# Altium schematic sheet 继电器模块.SchDoc
size A3
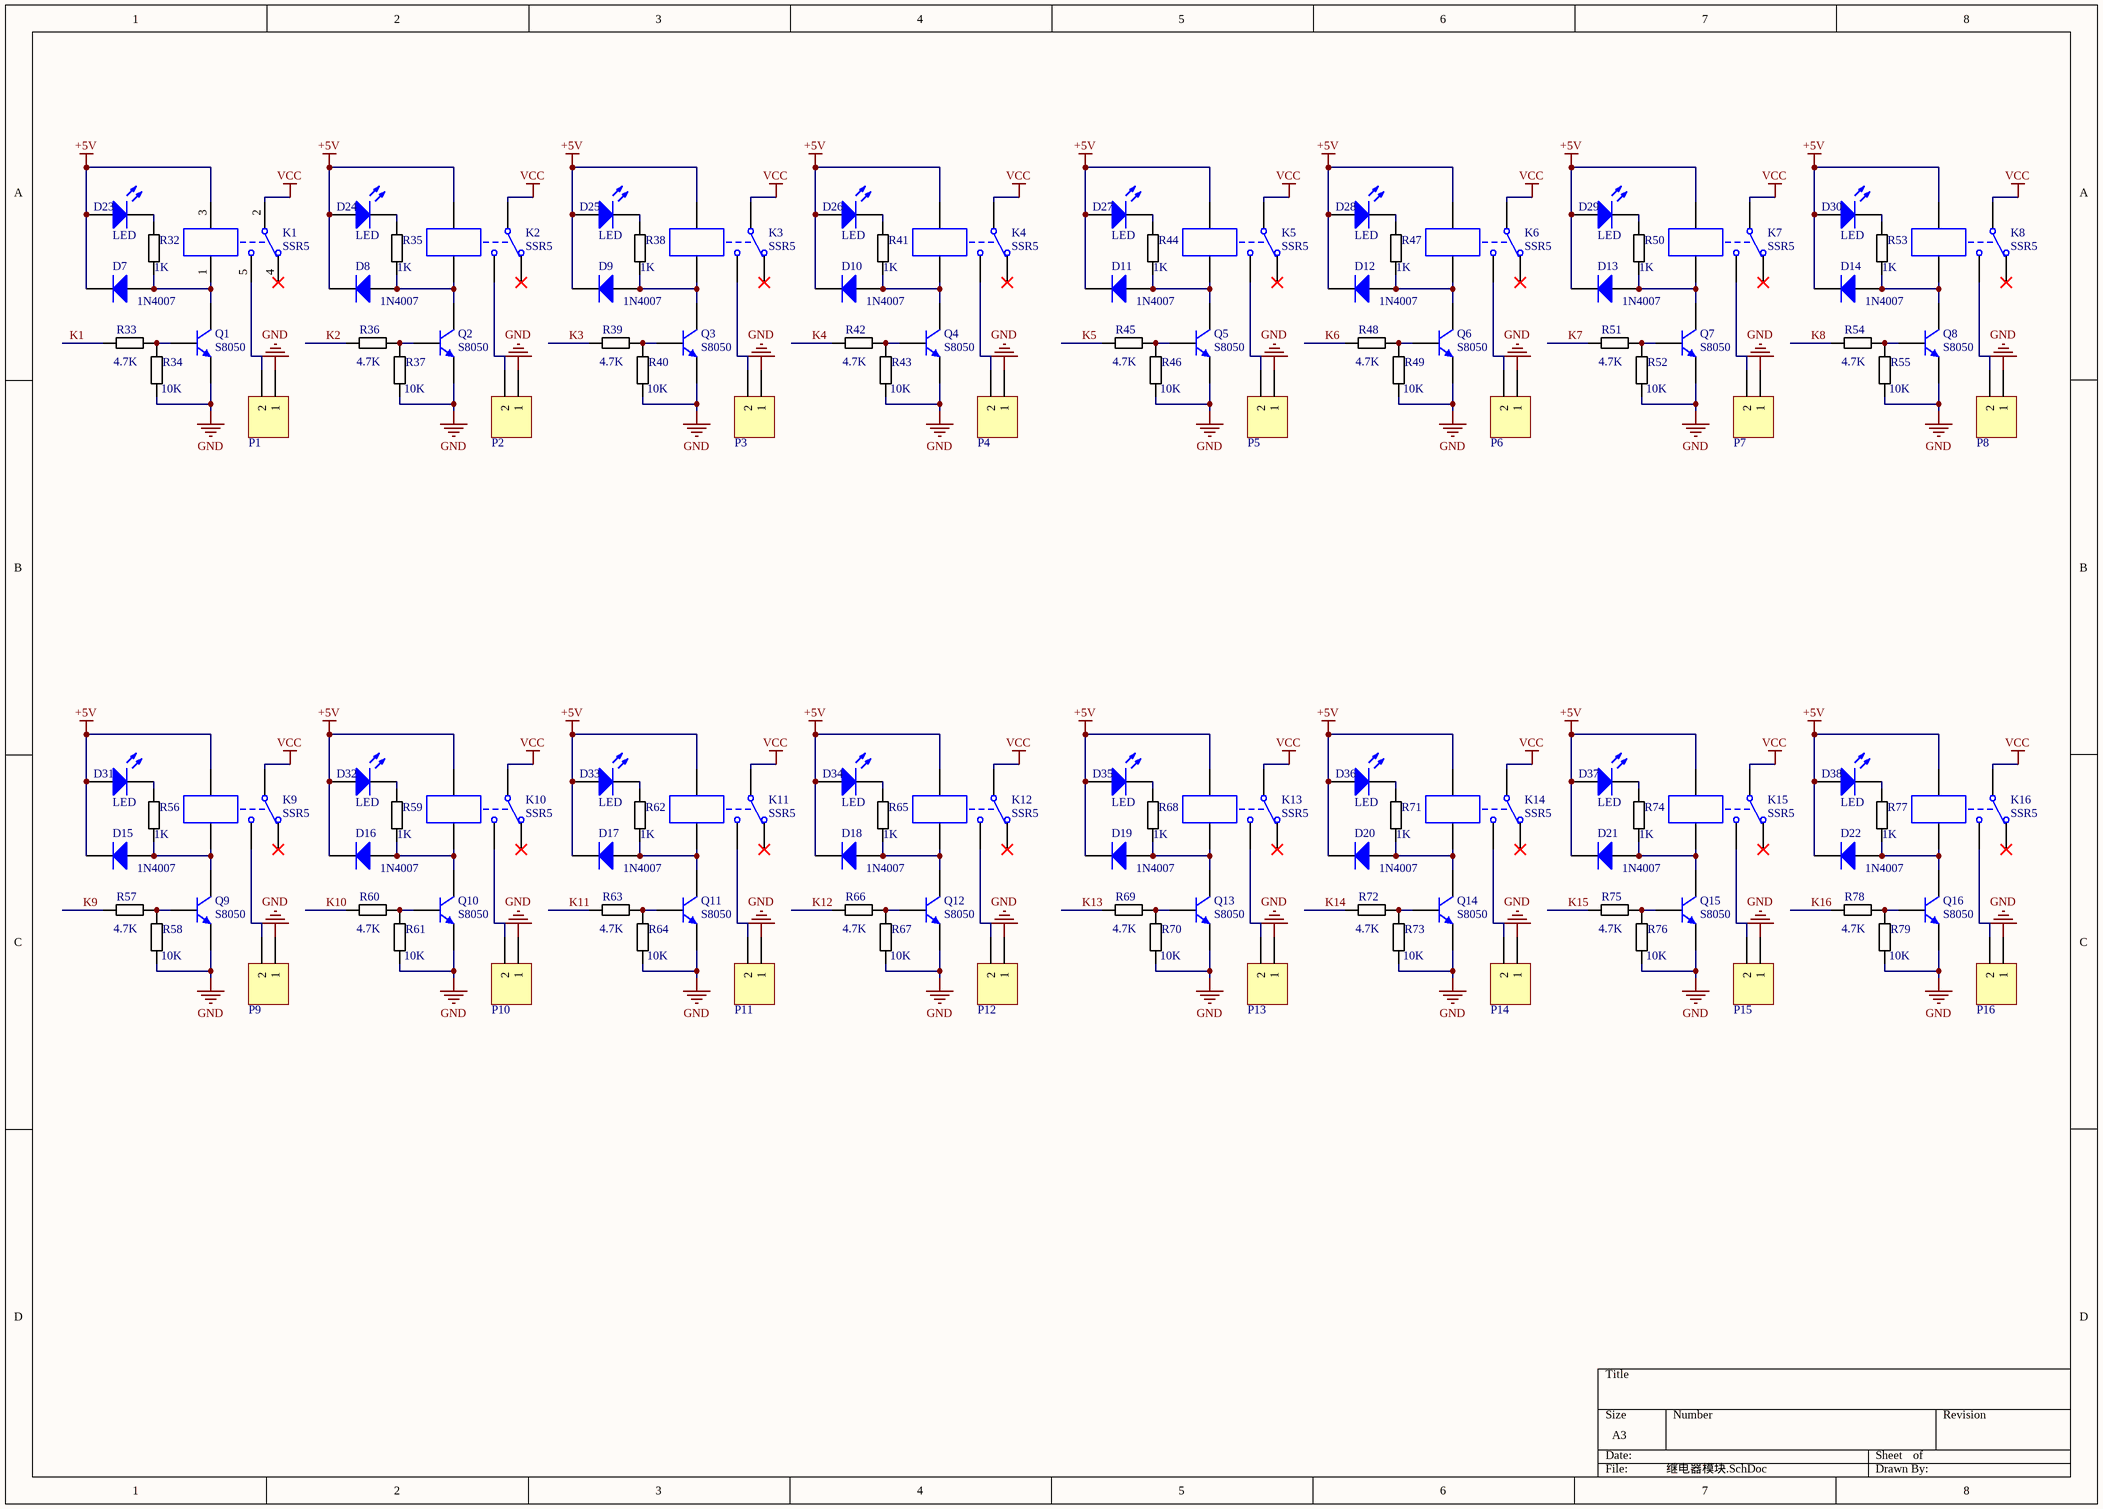
[diagram p0: 继电器模块.SchDoc]

## Parts
D7  1N4007  [SMA]
D8  1N4007  [SMA]
D9  1N4007  [SMA]
D10  1N4007  [SMA]
D11  1N4007  [SMA]
D12  1N4007  [SMA]
D13  1N4007  [SMA]
D14  1N4007  [SMA]
D15  1N4007  [SMA]
D16  1N4007  [SMA]
D17  1N4007  [SMA]
D18  1N4007  [SMA]
D19  1N4007  [SMA]
D20  1N4007  [SMA]
D21  1N4007  [SMA]
D22  1N4007  [SMA]
D23  LED  [LED]
D24  LED  [LED]
D25  LED  [LED]
D26  LED  [LED]
D27  LED  [LED]
D28  LED  [LED]
D29  LED  [LED]
D30  LED  [LED]
D31  LED  [LED]
D32  LED  [LED]
D33  LED  [LED]
D34  LED  [LED]
D35  LED  [LED]
D36  LED  [LED]
D37  LED  [LED]
D38  LED  [LED]
K1  SSR5  [SSR-DC5]
K2  SSR5  [SSR-DC5]
K3  SSR5  [SSR-DC5]
K4  SSR5  [SSR-DC5]
K5  SSR5  [SSR-DC5]
K6  SSR5  [SSR-DC5]
K7  SSR5  [SSR-DC5]
K8  SSR5  [SSR-DC5]
K9  SSR5  [SSR-DC5]
K10  SSR5  [SSR-DC5]
K11  SSR5  [SSR-DC5]
K12  SSR5  [SSR-DC5]
K13  SSR5  [SSR-DC5]
K14  SSR5  [SSR-DC5]
K15  SSR5  [SSR-DC5]
K16  SSR5  [SSR-DC5]
P1  Header 2  [电源]  (value not drawn)
P2  Header 2  [电源]  (value not drawn)
P3  Header 2  [电源]  (value not drawn)
P4  Header 2  [电源]  (value not drawn)
P5  Header 2  [电源]  (value not drawn)
P6  Header 2  [电源]  (value not drawn)
P7  Header 2  [电源]  (value not drawn)
P8  Header 2  [电源]  (value not drawn)
P9  Header 2  [电源]  (value not drawn)
P10  Header 2  [电源]  (value not drawn)
P11  Header 2  [电源]  (value not drawn)
P12  Header 2  [电源]  (value not drawn)
P13  Header 2  [电源]  (value not drawn)
P14  Header 2  [电源]  (value not drawn)
P15  Header 2  [电源]  (value not drawn)
P16  Header 2  [电源]  (value not drawn)
Q1  S8050  [SOT-23]
Q2  S8050  [SOT-23]
Q3  S8050  [SOT-23]
Q4  S8050  [SOT-23]
Q5  S8050  [SOT-23]
Q6  S8050  [SOT-23]
Q7  S8050  [SOT-23]
Q8  S8050  [SOT-23]
Q9  S8050  [SOT-23]
Q10  S8050  [SOT-23]
Q11  S8050  [SOT-23]
Q12  S8050  [SOT-23]
Q13  S8050  [SOT-23]
Q14  S8050  [SOT-23]
Q15  S8050  [SOT-23]
Q16  S8050  [SOT-23]
R32  1K  [0603]
R33  4.7K  [0603]
R34  10K  [0603]
R35  1K  [0603]
R36  4.7K  [0603]
R37  10K  [0603]
R38  1K  [0603]
R39  4.7K  [0603]
R40  10K  [0603]
R41  1K  [0603]
R42  4.7K  [0603]
R43  10K  [0603]
R44  1K  [0603]
R45  4.7K  [0603]
R46  10K  [0603]
R47  1K  [0603]
R48  4.7K  [0603]
R49  10K  [0603]
R50  1K  [0603]
R51  4.7K  [0603]
R52  10K  [0603]
R53  1K  [0603]
R54  4.7K  [0603]
R55  10K  [0603]
R56  1K  [0603]
R57  4.7K  [0603]
R58  10K  [0603]
R59  1K  [0603]
R60  4.7K  [0603]
R61  10K  [0603]
R62  1K  [0603]
R63  4.7K  [0603]
R64  10K  [0603]
R65  1K  [0603]
R66  4.7K  [0603]
R67  10K  [0603]
R68  1K  [0603]
R69  4.7K  [0603]
R70  10K  [0603]
R71  1K  [0603]
R72  4.7K  [0603]
R73  10K  [0603]
R74  1K  [0603]
R75  4.7K  [0603]
R76  10K  [0603]
R77  1K  [0603]
R78  4.7K  [0603]
R79  10K  [0603]

## Nets
+5V: D7.2(K) D8.2(K) D9.2(K) D10.2(K) D11.2(K) D12.2(K) D13.2(K) D14.2(K) D15.2(K) D16.2(K) D17.2(K) D18.2(K) D19.2(K) D20.2(K) D21.2(K) D22.2(K) D23.1(A) D24.1(A) D25.1(A) D26.1(A) D27.1(A) D28.1(A) D29.1(A) D30.1(A) D31.1(A) D32.1(A) D33.1(A) D34.1(A) D35.1(A) D36.1(A) D37.1(A) D38.1(A) K1.3 K2.3 K3.3 K4.3 K5.3 K6.3 K7.3 K8.3 K9.3 K10.3 K11.3 K12.3 K13.3 K14.3 K15.3 K16.3
GND: P1.1 P2.1 P3.1 P4.1 P5.1 P6.1 P7.1 P8.1 P9.1 P10.1 P11.1 P12.1 P13.1 P14.1 P15.1 P16.1 Q1.2(E) Q2.2(E) Q3.2(E) Q4.2(E) Q5.2(E) Q6.2(E) Q7.2(E) Q8.2(E) Q9.2(E) Q10.2(E) Q11.2(E) Q12.2(E) Q13.2(E) Q14.2(E) Q15.2(E) Q16.2(E) R34.2 R37.2 R40.2 R43.2 R46.2 R49.2 R52.2 R55.2 R58.2 R61.2 R64.2 R67.2 R70.2 R73.2 R76.2 R79.2
VCC: K1.2 K2.2 K3.2 K4.2 K5.2 K6.2 K7.2 K8.2 K9.2 K10.2 K11.2 K12.2 K13.2 K14.2 K15.2 K16.2
K1: R33.2
K2: R36.2
K3: R39.2
K4: R42.2
K5: R45.2
K6: R48.2
K7: R51.2
K8: R54.2
K9: R57.2
K10: R60.2
K11: R63.2
K12: R66.2
K13: R69.2
K14: R72.2
K15: R75.2
K16: R78.2
NetD7_1: D7.1(A) K1.1 Q1.3(C) R32.1
NetD8_1: D8.1(A) K2.1 Q2.3(C) R35.1
NetD9_1: D9.1(A) K3.1 Q3.3(C) R38.1
NetD10_1: D10.1(A) K4.1 Q4.3(C) R41.1
NetD11_1: D11.1(A) K5.1 Q5.3(C) R44.1
NetD12_1: D12.1(A) K6.1 Q6.3(C) R47.1
NetD13_1: D13.1(A) K7.1 Q7.3(C) R50.1
NetD14_1: D14.1(A) K8.1 Q8.3(C) R53.1
NetD15_1: D15.1(A) K9.1 Q9.3(C) R56.1
NetD16_1: D16.1(A) K10.1 Q10.3(C) R59.1
NetD17_1: D17.1(A) K11.1 Q11.3(C) R62.1
NetD18_1: D18.1(A) K12.1 Q12.3(C) R65.1
NetD19_1: D19.1(A) K13.1 Q13.3(C) R68.1
NetD20_1: D20.1(A) K14.1 Q14.3(C) R71.1
NetD21_1: D21.1(A) K15.1 Q15.3(C) R74.1
NetD22_1: D22.1(A) K16.1 Q16.3(C) R77.1
NetD23_2: D23.2(K) R32.2
NetD24_2: D24.2(K) R35.2
NetD25_2: D25.2(K) R38.2
NetD26_2: D26.2(K) R41.2
NetD27_2: D27.2(K) R44.2
NetD28_2: D28.2(K) R47.2
NetD29_2: D29.2(K) R50.2
NetD30_2: D30.2(K) R53.2
NetD31_2: D31.2(K) R56.2
NetD32_2: D32.2(K) R59.2
NetD33_2: D33.2(K) R62.2
NetD34_2: D34.2(K) R65.2
NetD35_2: D35.2(K) R68.2
NetD36_2: D36.2(K) R71.2
NetD37_2: D37.2(K) R74.2
NetD38_2: D38.2(K) R77.2
NetK1_5: K1.5 P1.2
NetK2_5: K2.5 P2.2
NetK3_5: K3.5 P3.2
NetK4_5: K4.5 P4.2
NetK5_5: K5.5 P5.2
NetK6_5: K6.5 P6.2
NetK7_5: K7.5 P7.2
NetK8_5: K8.5 P8.2
NetK9_5: K9.5 P9.2
NetK10_5: K10.5 P10.2
NetK11_5: K11.5 P11.2
NetK12_5: K12.5 P12.2
NetK13_5: K13.5 P13.2
NetK14_5: K14.5 P14.2
NetK15_5: K15.5 P15.2
NetK16_5: K16.5 P16.2
NetQ1_1: Q1.1(B) R33.1 R34.1
NetQ2_1: Q2.1(B) R36.1 R37.1
NetQ3_1: Q3.1(B) R39.1 R40.1
NetQ4_1: Q4.1(B) R42.1 R43.1
NetQ5_1: Q5.1(B) R45.1 R46.1
NetQ6_1: Q6.1(B) R48.1 R49.1
NetQ7_1: Q7.1(B) R51.1 R52.1
NetQ8_1: Q8.1(B) R54.1 R55.1
NetQ9_1: Q9.1(B) R57.1 R58.1
NetQ10_1: Q10.1(B) R60.1 R61.1
NetQ11_1: Q11.1(B) R63.1 R64.1
NetQ12_1: Q12.1(B) R66.1 R67.1
NetQ13_1: Q13.1(B) R69.1 R70.1
NetQ14_1: Q14.1(B) R72.1 R73.1
NetQ15_1: Q15.1(B) R75.1 R76.1
NetQ16_1: Q16.1(B) R78.1 R79.1

Not connected (* = marked no-connect by the designer): K1 4*; K2 4*; K3 4*; K4 4*; K5 4*; K6 4*; K7 4*; K8 4*; K9 4*; K10 4*; K11 4*; K12 4*; K13 4*; K14 4*; K15 4*; K16 4*

## Library data of the parts
D7-D22 = Diode 1N4007: 1 Amp General Purpose Rectifier; Published: 8-Jun-2000; LatestRevisionDate: 17-Jul-2002; LatestRevisionNote: Re-released for DXP Platform.; DatasheetVersion: 1998; PackageVersion: Aug-1999; PackageReference: DO-41; Publisher: Altium Limited; Code_JEDEC: DO-204-AL; ComponentLink1Description: Manufacturer Link; ComponentLink1URL: http://www.fairchildsemi.com/; ComponentLink2Description: Datasheet; ComponentLink2URL: http://www.fairchildsemi.com/ds/1N%2F1N4001.pdf
P1-P16 = Header 2: Header, 2-Pin; LatestRevisionDate: 17-Jul-2002; LatestRevisionNote: Re-released for DXP Platform.; Publisher: Altium Limited
R32-R79 = RES-1K
  R32 R35 R38 R41 R44 R47 R50 R53 R56 R59 R62 R65 R68 R71 R74 R77: Value: 1K
  R33 R36 R39 R42 R45 R48 R51 R54 R57 R60 R63 R66 R69 R72 R75 R78: Value: 4.7K
  R34 R37 R40 R43 R46 R49 R52 R55 R58 R61 R64 R67 R70 R73 R76 R79: Value: 10K
K1-K16 = SSR5: Published: 24-Mar-1999; LatestRevisionDate: 17-Jul-2002; LatestRevisionNote: Re-released for DXP Platform.; PackageReference: MODULE5B; Publisher: Altium Limited